# Altium project Waspmoteprint_Diff_zu_I2C.PrjPcb
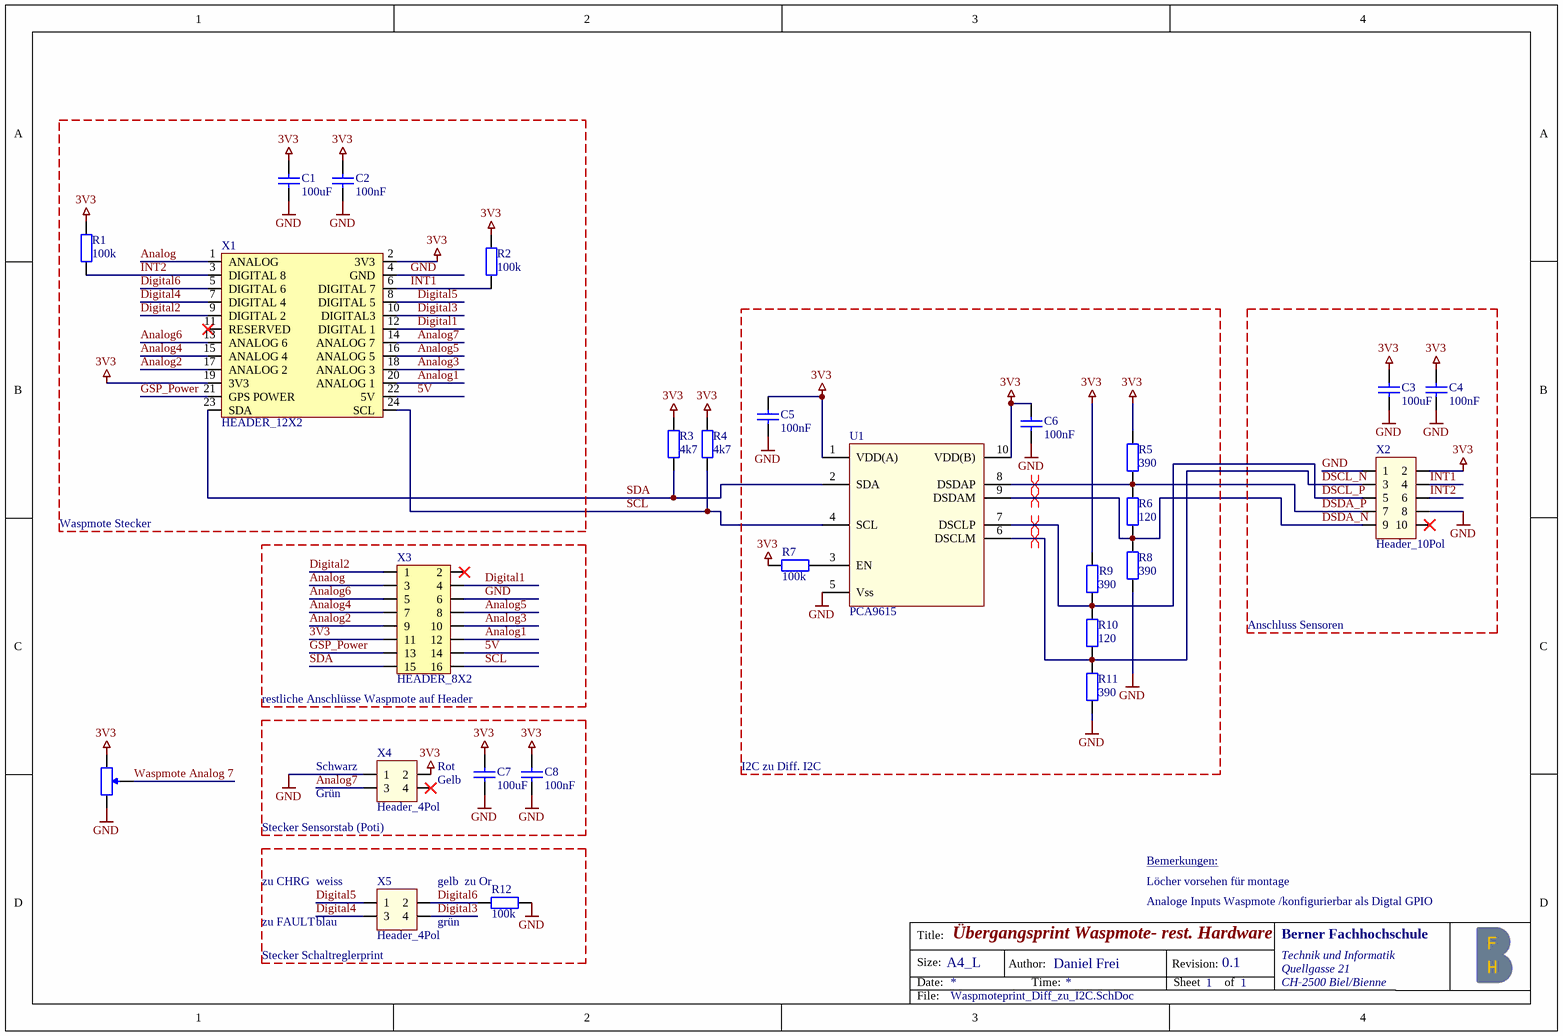
[diagram p0: Waspmoteprint_Diff_zu_I2C.SchDoc]
1 sheet, 27 parts. Net scope: global (net labels, ports and power ports of the same name join across sheets).
Board file: Waspmoteprint_Diff_zu_I2C.PcbDoc

## Sheet Waspmoteprint_Diff_zu_I2C.SchDoc: Übergangsprint Waspmote- rest. Hardware
size A4; Organization: Berner Fachhochschule; Address1: Technik und Informatik; Address2: Quellgasse 21; Address3: CH-2500 Biel/Bienne; Address4: Switzerland; Revision: 0.1; SheetNumber: 1; SheetTotal: 1; Date: 11.05.2016; Author: Daniel Frei; DrawnBy: Daniel Frei; ProjectName: Rock Monitoring

### Parts
?  (no value)  [BOURNS3296W]
C1  100uF  [CAPC3225[1210]X120]
C2  100nF  [CAPC1005[0402]X50]
C3  100uF  [CAPC3225[1210]X120]
C4  100nF  [CAPC1005[0402]X50]
C5  100nF  [CAPC1005[0402]X50]
C6  100nF  [CAPC1005[0402]X50]
C7  100uF  [CAPC3225[1210]X120]
C8  100nF  [CAPC1005[0402]X50]
R1  100k  [RESC1005[0402]X35]
R2  100k  [RESC1005[0402]X35]
R3  4k7  [RESC1005[0402]X35]
R4  4k7  [RESC1005[0402]X35]
R5  390  [RESC1005[0402]X35]
R6  120  [RESC1005[0402]X35]
R7  100k  [RESC1005[0402]X35]
R8  390  [RESC1005[0402]X35]
R9  390  [RESC1005[0402]X35]
R10  120  [RESC1005[0402]X35]
R11  390  [RESC1005[0402]X35]
R12  100k  [RESC1005[0402]X35]
U1  PCA9615  [TSSOP10]
X1  HEADER_12X2  [HDR2X12_V_M]
X2  Header_10Pol  [Header_2mm_10Pol]
X3  HEADER_8X2  [HDR2X8_V_M]
X4  Header_4Pol  [Header_2mm_4Pol]
X5  Header_4Pol  [Header_2mm_4Pol]

### Blocks framed on the sheet
Waspmote Stecker: C1 C2 R1 R2 X1
I2C zu Diff. I2C: C5 C6 R5-R11 U1
Anschluss Sensoren: C3 C4 X2
restliche Anschlüsse Waspmote auf Header: X3

### Nets
3V3: ?.3(CW) C1.2 C2.2 C3.2 C4.2 C5.2 C6.2 C7.2 C8.2 R1.2 R2.2 R3.2 R4.2 R5.2 R7.1 R9.2 U1.1(VDD(A)) U1.10(VDD(B)) X1.2(3V3) X1.19(3V3) X2.2 X3.11 X4.2
GND: ?.1(CCW) C1.1 C2.1 C3.1 C4.1 C5.1 C6.1 C7.1 C8.1 R8.1 R11.1 R12.1 U1.5(Vss) X1.4(GND) X2.1 X2.8 X3.6 X4.1
5V: X1.22(5V) X3.14
Analog: X1.1(ANALOG) X3.3
Analog1: X1.20(ANALOG_1) X3.12
Analog2: X1.17(ANALOG_2) X3.9
Analog3: X1.18(ANALOG_3) X3.10
Analog4: X1.15(ANALOG_4) X3.7
Analog5: X1.16(ANALOG_5) X3.8
Analog6: X1.13(ANALOG_6) X3.5
Analog7: X1.14(ANALOG_7) X4.3
Digital1: X1.12(DIGITAL_1) X3.4
Digital2: X1.9(DIGITAL_2) X3.1
Digital3: X1.10(DIGITAL3) X5.4
Digital4: X1.7(DIGITAL_4) X5.3
Digital5: X1.8(DIGITAL_5) X5.1
Digital6: R12.2 X1.5(DIGITAL_6) X5.2
DSCL_N: R10.1 R11.2 U1.6(DSCLM) X2.3
DSCL_P: R9.1 R10.2 U1.7(DSCLP) X2.5
DSDA_N: R6.1 R8.2 U1.9(DSDAM) X2.9
DSDA_P: R5.1 R6.2 U1.8(DSDAP) X2.7
GSP_Power: X1.21(GPS_POWER) X3.13
INT1: R2.1 X1.6(DIGITAL_7) X2.4
INT2: R1.1 X1.3(DIGITAL_8) X2.6
SCL: R4.1 U1.4(SCL) X1.24(SCL) X3.16
SDA: R3.1 U1.2(SDA) X1.23(SDA) X3.15
Waspmote Analog 7: ?.2(Wiper)
NetR7_2: R7.2 U1.3(EN)

Not connected (* = marked no-connect by the designer): X1 11(RESERVED)*; X2 10*; X3 2*; X4 4*

### Layout directives
differential pair: DSCL_N, DSCL_P, DSDA_N, DSDA_P

### Notes on the sheet
- (near X4) Schwarz
- Rot
- Gelb
- (near X4) Stecker Sensorstab (Poti)
- (near X4) Grün
- zu CHRG
- zu FAULT
- (near X5) blau
- (near X5) weiss
- grün
- gelb
- (near R12) zu Or
- Analoge Inputs Waspmote /konfigurierbar als Digtal GPIO
- Löcher vorsehen für montage
- Bemerkungen:
- (near X5) Stecker Schaltreglerprint
- Title:
- Size:
- Date:
- A4_L
- Author:
- Time:
- Revision:
- Sheet
- of
- File:

### Library data of the parts
? = POT2: Variable Resistor; LatestRevisionDate: 10-July-2013; Publisher: Bep1
C1 C3 C7 = C: Capacitor; Manufacturer: Murata; Manufacturer Part Number: GRM32ER61A107ME20L; Modified_by: BEP1; Modified: 10.2008; Type: *; Voltage: *; Value: 100uF; Supplier 1: Digi-Key; Supplier 2: Mouser; Supplier Part Number 1: 490-9969-1-ND; Supplier Part Number 2: 81-GRM32ER61A107ME0L
C2 C4-C6 C8 = C: Capacitor; Modified_by: BEP1; Modified: 10.2008; Type: *; Voltage: *; Value: 100nF
R1-R12 = R: Resistor; Modified_by: BEP1; Modified: 10.2008
  R1 R2 R7 R12: Value: 100k
  R3 R4: Value: 4k7
  R5 R8 R9 R11: Value: 390
  R6 R10: Value: 120
U1 = PCA9615: differential I2C-bus buffer; Manufacturer Part Number: PCA9615DPJ; Manufacturer: NXP; Value: PCA9615; Supplier Part Number 2: 771-PCA9615DPJ; Supplier Part Number 1: 568-11484-1-ND; Supplier 1: Digi-Key; Supplier 2: Mouser
X1 = HEADER_12X2: Header, 12-Pin, Dual row; Supplier 1: *; Supplier 2: *; Manufacturer: *; Manufacturer Part Number: *; Supplier Part Number 1: *; Supplier Part Number 2: *
X2 = Header_Hirose_10: Header Hirose 10 Pol; Manufacturer Part Number: DF11-10DP-2DSA(24); Value: Header_10Pol; Supplier 1: Digi-Key; Manufacturer: Hirose; Supplier Part Number 1: H10232-ND; Supplier 2: Mouser; Supplier Part Number 2: 798-DF11-10DP-2DSA24
X3 = HEADER_8X2: Header, 16-Pin, Dual row; Supplier 1: *; Supplier 2: *; Manufacturer: *; Manufacturer Part Number: *; Supplier Part Number 1: *; Supplier Part Number 2: *
X4 X5 = Header_Hirose_4: Header Hirose 4 Pol; Manufacturer Part Number: DF11-4DP-2DSA(24); Value: Header_4Pol; Supplier 1: Digi-Key; Manufacturer: Hirose; Supplier Part Number 1: H10229-ND; Supplier 2: Mouser; Supplier Part Number 2: 798-DF11-4DP-2DSA24